# EasyEDA Pro project ProPrj_LillyPadPro_2025-09-27.epro

# Schematic LillyPadPro
Board Name: LillyPadPro; Create Date: 2025-09-27; Page Name: Sheet_1; Project Name: LillyPadPro; Schematic Name: LillyPadPro; Update Date: 2025-09-27; Add into BOM: yes; Company: Your Company; Convert to PCB: yes; Date: 2023-05-16; Draw By: waxcoin; REV: 1.0; Sheet: 1/1; spicePre: .
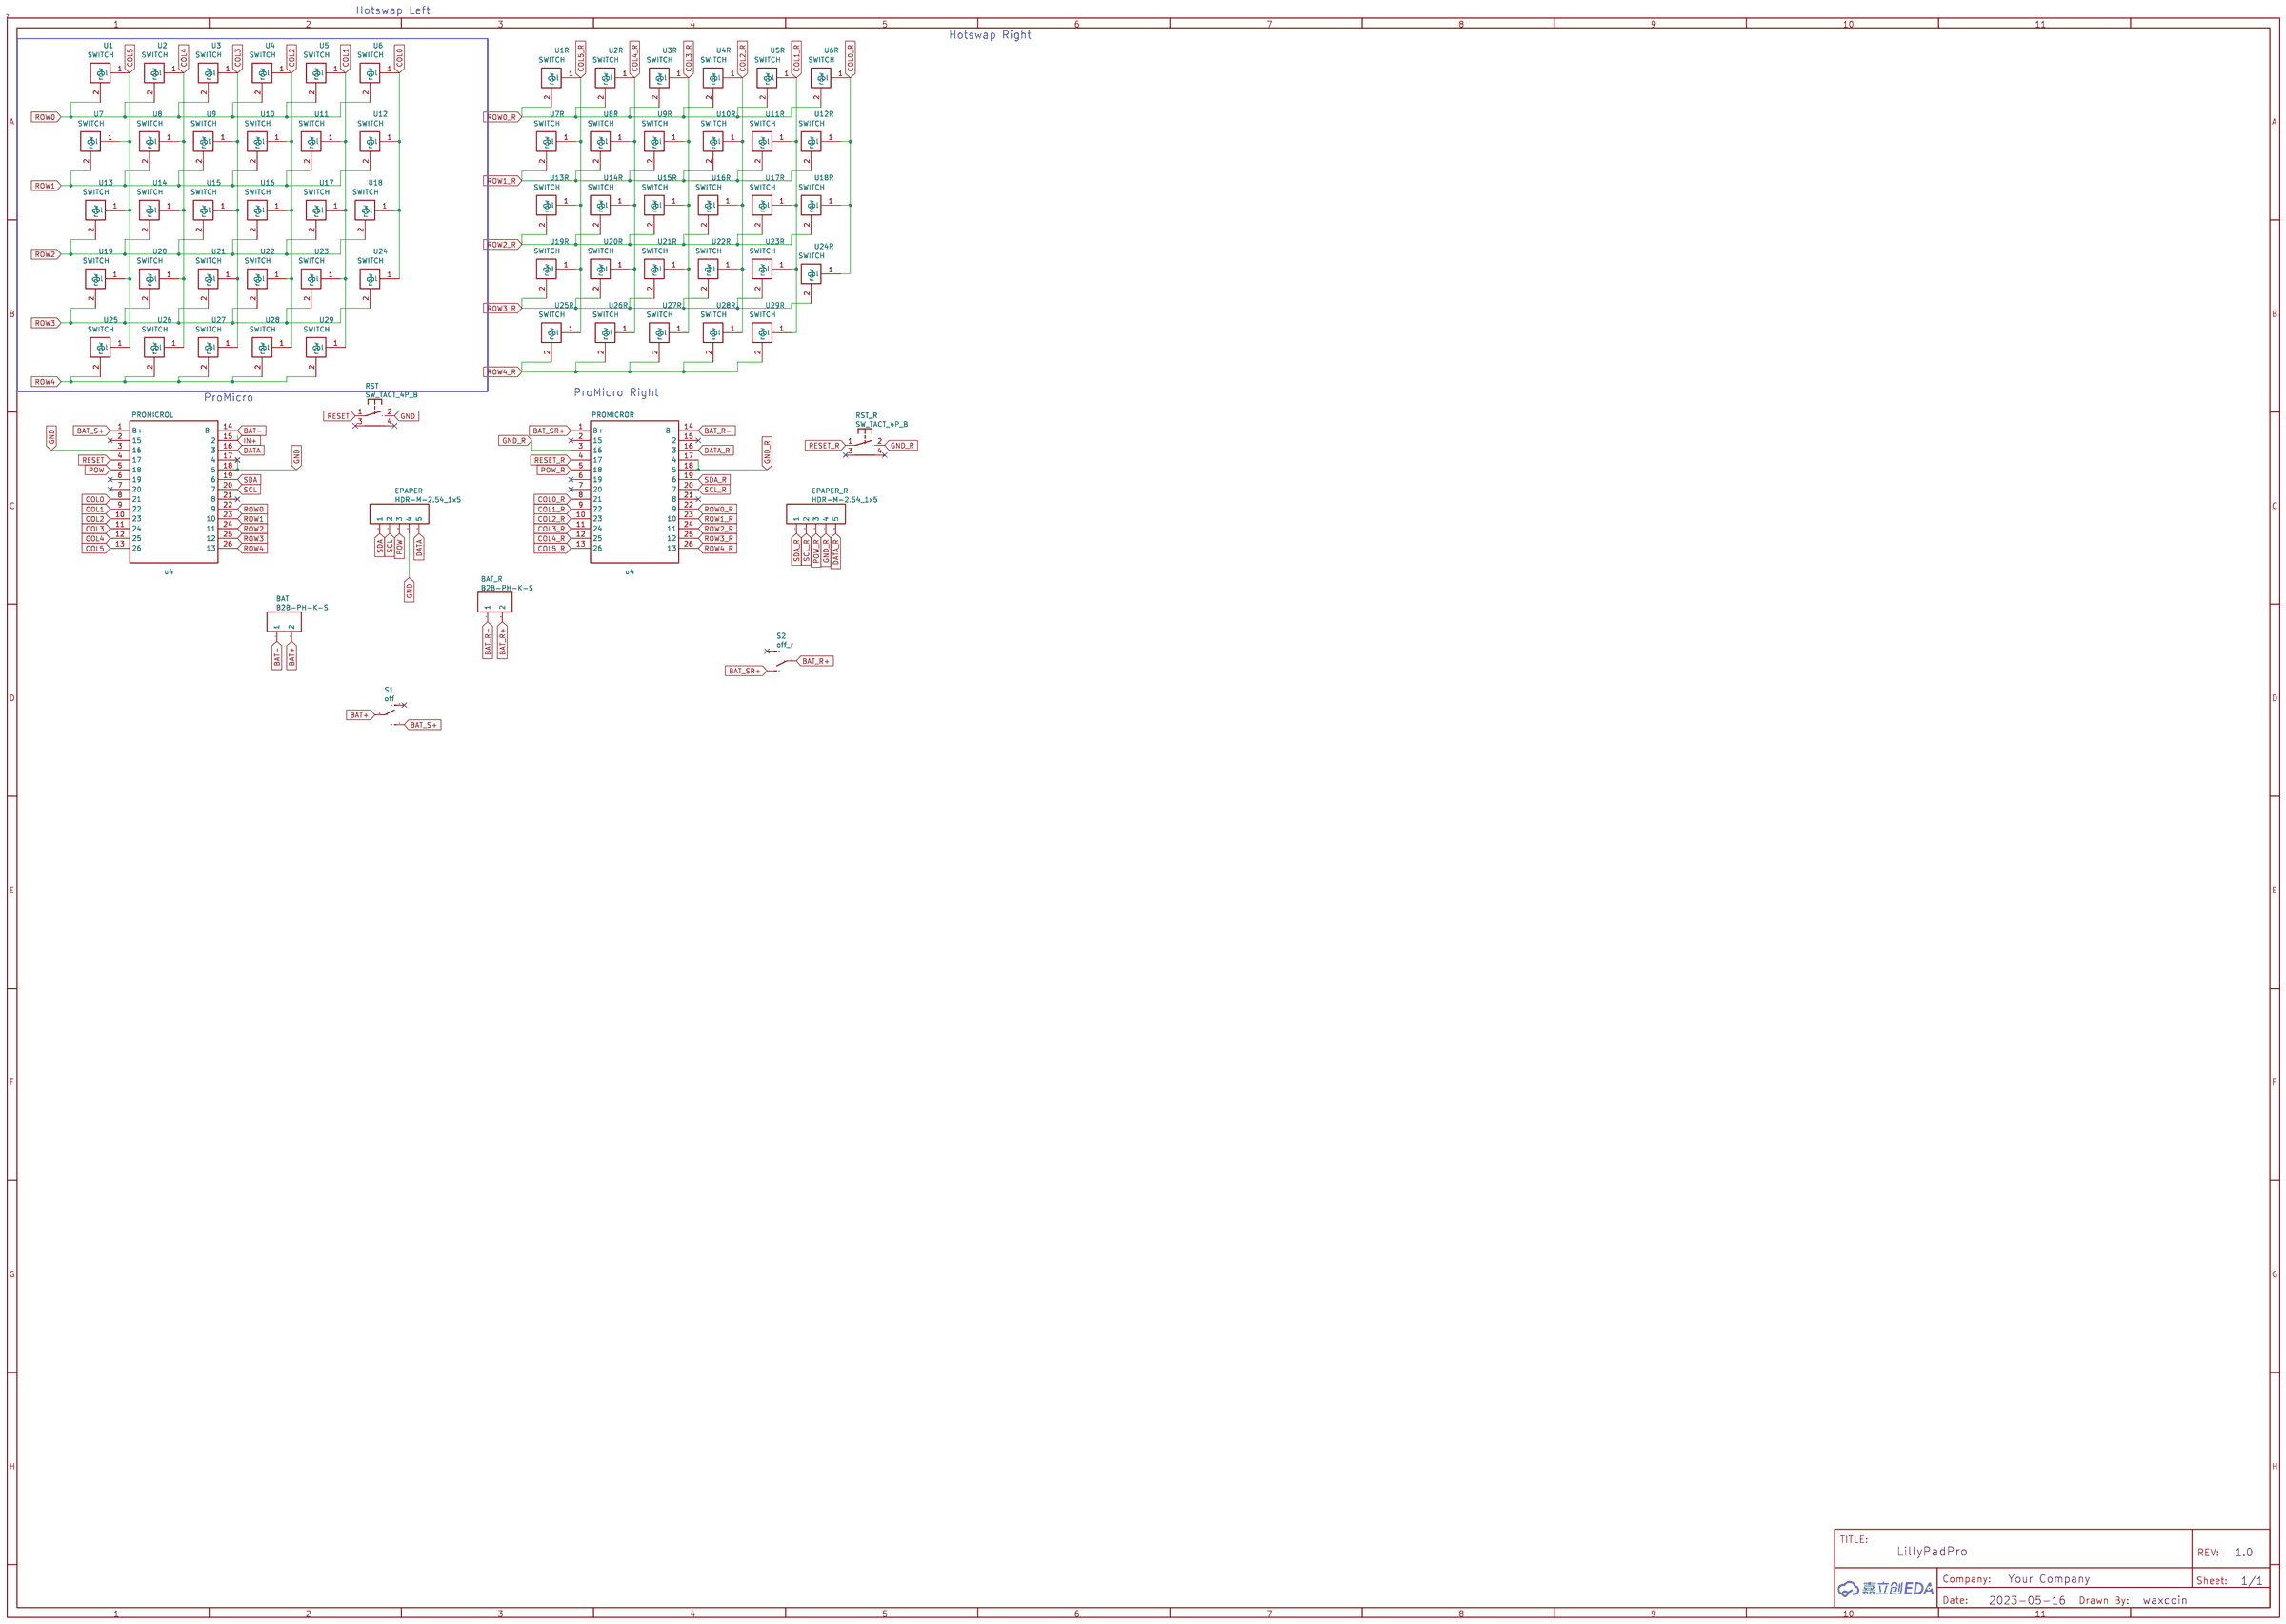
[diagram p0: schematic sheet]

## Parts
BAT  B2B-PH-K-S  [B2B-PH-K-S]
BAT_R  B2B-PH-K-S  [B2B-PH-K-S]
EPAPER  HDR-M-2.54_1x5  [NICE!VIEW - BASIC]
EPAPER_R  HDR-M-2.54_1x5  [NICE!VIEW - BASIC]
PROMICROL  u4  [NICE!NANO_HOTSWAP]
PROMICROR  u4  [NICE!NANO_HOTSWAP]
RST  SW_TACT_4P_B  [SW-SMD_L8.0-W3.5_3-6-3.5MM]
RST_R  SW_TACT_4P_B  [SW-SMD_L8.0-W3.5_3-6-3.5MM]
S1  off  [SWITCH-SPST-SMD-A]
S2  off_r  [SWITCH-SPST-SMD-A]
U1  SWITCH  [MXCHOC-HOTSWAP_WAX]
U1R  SWITCH  [MXCHOC-HOTSWAP_WAX]
U2  SWITCH  [MXCHOC-HOTSWAP_WAX]
U2R  SWITCH  [MXCHOC-HOTSWAP_WAX]
U3  SWITCH  [MXCHOC-HOTSWAP_WAX]
U3R  SWITCH  [MXCHOC-HOTSWAP_WAX]
U4  SWITCH  [MXCHOC-HOTSWAP_WAX]
U4R  SWITCH  [MXCHOC-HOTSWAP_WAX]
U5  SWITCH  [MXCHOC-HOTSWAP_WAX]
U5R  SWITCH  [MXCHOC-HOTSWAP_WAX]
U6  SWITCH  [MXCHOC-HOTSWAP_WAX]
U6R  SWITCH  [MXCHOC-HOTSWAP_WAX]
U7  SWITCH  [MXCHOC-HOTSWAP_WAX]
U7R  SWITCH  [MXCHOC-HOTSWAP_WAX]
U8  SWITCH  [MXCHOC-HOTSWAP_WAX]
U8R  SWITCH  [MXCHOC-HOTSWAP_WAX]
U9  SWITCH  [MXCHOC-HOTSWAP_WAX]
U9R  SWITCH  [MXCHOC-HOTSWAP_WAX]
U10  SWITCH  [MXCHOC-HOTSWAP_WAX]
U10R  SWITCH  [MXCHOC-HOTSWAP_WAX]
U11  SWITCH  [MXCHOC-HOTSWAP_WAX]
U11R  SWITCH  [MXCHOC-HOTSWAP_WAX]
U12  SWITCH  [MXCHOC-HOTSWAP_WAX]
U12R  SWITCH  [MXCHOC-HOTSWAP_WAX]
U13  SWITCH  [MXCHOC-HOTSWAP_WAX]
U13R  SWITCH  [MXCHOC-HOTSWAP_WAX]
U14  SWITCH  [MXCHOC-HOTSWAP_WAX]
U14R  SWITCH  [MXCHOC-HOTSWAP_WAX]
U15  SWITCH  [MXCHOC-HOTSWAP_WAX]
U15R  SWITCH  [MXCHOC-HOTSWAP_WAX]
U16  SWITCH  [MXCHOC-HOTSWAP_WAX]
U16R  SWITCH  [MXCHOC-HOTSWAP_WAX]
U17  SWITCH  [MXCHOC-HOTSWAP_WAX]
U17R  SWITCH  [MXCHOC-HOTSWAP_WAX]
U18  SWITCH  [MXCHOC-HOTSWAP_WAX]
U18R  SWITCH  [MXCHOC-HOTSWAP_WAX]
U19  SWITCH  [MXCHOC-HOTSWAP_WAX]
U19R  SWITCH  [MXCHOC-HOTSWAP_WAX]
U20  SWITCH  [MXCHOC-HOTSWAP_WAX]
U20R  SWITCH  [MXCHOC-HOTSWAP_WAX]
U21  SWITCH  [MXCHOC-HOTSWAP_WAX]
U21R  SWITCH  [MXCHOC-HOTSWAP_WAX]
U22  SWITCH  [MXCHOC-HOTSWAP_WAX]
U22R  SWITCH  [MXCHOC-HOTSWAP_WAX]
U23  SWITCH  [MXCHOC-HOTSWAP_WAX]
U23R  SWITCH  [MXCHOC-HOTSWAP_WAX]
U24  SWITCH  [MXCHOC-HOTSWAP_WAX]
U24R  SWITCH  [MXCHOC-HOTSWAP_WAX]
U25  SWITCH  [MXCHOC-HOTSWAP_WAX]
U25R  SWITCH  [MXCHOC-HOTSWAP_WAX]
U26  SWITCH  [MXCHOC-HOTSWAP_WAX]
U26R  SWITCH  [MXCHOC-HOTSWAP_WAX]
U27  SWITCH  [MXCHOC-HOTSWAP_WAX]
U27R  SWITCH  [MXCHOC-HOTSWAP_WAX]
U28  SWITCH  [MXCHOC-HOTSWAP_WAX]
U28R  SWITCH  [MXCHOC-HOTSWAP_WAX]
U29  SWITCH  [MXCHOC-HOTSWAP_WAX]
U29R  SWITCH  [MXCHOC-HOTSWAP_WAX]

## Library data of the parts
BAT BAT_R = B2B-PH-K-S: Supplier: RS-Online; Manufacturer: JST Sales America; Contributor: single_coil_hum; spicePre: J
EPAPER EPAPER_R = HDR-M-2.54_1x5: Supplier Part: C358687; Supplier: LCSC; Contributor: LCEDA_Lib; spicePre: J
PROMICROL PROMICROR = u4
RST RST_R = SW_TACT_4P_B: Contributor: DangerousPrototype; spicePre: S
S1 = off: Contributor: SparkFun; spicePre: S; spiceSymbolName: SWITCH-SPDT-SMD-A
S2 = off_r: Contributor: SparkFun; spicePre: S; spiceSymbolName: SWITCH-SPDT-SMD-A
U1 U1R U2 U2R U3 U3R U4 U4R U5 U5R U6 U6R U7 U7R U8 U8R U9 U9R U10 U10R U11 U11R U12 U12R U13 U13R U14 U14R U15 U15R U16 U16R U17 U17R U18 U18R U19 U19R U20 U20R U21 U21R U22 U22R U23 U23R U24 U24R U25 U25R U26 U26R U27 U27R U28 U28R U29 U29R = SWITCH: Contributor: angeloger087; spicePre: U; spiceSymbolName: CHERRY_MX_SWITCH

## Nets
GND: EPAPER.4 PROMICROL.3(16) PROMICROL.17(4) PROMICROL.18(5) RST.2
GND_R: EPAPER_R.4 PROMICROR.3(16) PROMICROR.17(4) PROMICROR.18(5) RST_R.2
BAT+: BAT.2 S1.2(P)
BAT-: BAT.1 PROMICROL.14(B-)
BAT_R+: BAT_R.2 S2.2(P)
BAT_R-: BAT_R.1 PROMICROR.14(B-)
BAT_S+: PROMICROL.1(B+) S1.3(S)
BAT_SR+: PROMICROR.1(B+) S2.1(O)
COL0: PROMICROL.8(21) U6.1(col) U12.1(col) U18.1(col) U24.1(col)
COL0_R: PROMICROR.8(21) U6R.1(col) U12R.1(col) U18R.1(col) U24R.1(col)
COL1: PROMICROL.9(22) U5.1(col) U11.1(col) U17.1(col) U23.1(col) U29.1(col)
COL1_R: PROMICROR.9(22) U5R.1(col) U11R.1(col) U17R.1(col) U23R.1(col) U29R.1(col)
COL2: PROMICROL.10(23) U4.1(col) U10.1(col) U16.1(col) U22.1(col) U28.1(col)
COL2_R: PROMICROR.10(23) U4R.1(col) U10R.1(col) U16R.1(col) U22R.1(col) U28R.1(col)
COL3: PROMICROL.11(24) U3.1(col) U9.1(col) U15.1(col) U21.1(col) U27.1(col)
COL3_R: PROMICROR.11(24) U3R.1(col) U9R.1(col) U15R.1(col) U21R.1(col) U27R.1(col)
COL4: PROMICROL.12(25) U2.1(col) U8.1(col) U14.1(col) U20.1(col) U26.1(col)
COL4_R: PROMICROR.12(25) U2R.1(col) U8R.1(col) U14R.1(col) U20R.1(col) U26R.1(col)
COL5: PROMICROL.13(26) U1.1(col) U7.1(col) U13.1(col) U19.1(col) U25.1(col)
COL5_R: PROMICROR.13(26) U1R.1(col) U7R.1(col) U13R.1(col) U19R.1(col) U25R.1(col)
DATA: EPAPER.5 PROMICROL.16(3)
DATA_R: EPAPER_R.5 PROMICROR.16(3)
IN+: PROMICROL.15(2)
POW: EPAPER.3 PROMICROL.5(18)
POW_R: EPAPER_R.3 PROMICROR.5(18)
RESET: PROMICROL.4(17) RST.1
RESET_R: PROMICROR.4(17) RST_R.1
ROW0: PROMICROL.22(9) U1.2(row) U2.2(row) U3.2(row) U4.2(row) U5.2(row) U6.2(row)
ROW0_R: PROMICROR.22(9) U1R.2(row) U2R.2(row) U3R.2(row) U4R.2(row) U5R.2(row) U6R.2(row)
ROW1: PROMICROL.23(10) U7.2(row) U8.2(row) U9.2(row) U10.2(row) U11.2(row) U12.2(row)
ROW1_R: PROMICROR.23(10) U7R.2(row) U8R.2(row) U9R.2(row) U10R.2(row) U11R.2(row) U12R.2(row)
ROW2: PROMICROL.24(11) U13.2(row) U14.2(row) U15.2(row) U16.2(row) U17.2(row) U18.2(row)
ROW2_R: PROMICROR.24(11) U13R.2(row) U14R.2(row) U15R.2(row) U16R.2(row) U17R.2(row) U18R.2(row)
ROW3: PROMICROL.25(12) U19.2(row) U20.2(row) U21.2(row) U22.2(row) U23.2(row) U24.2(row)
ROW3_R: PROMICROR.25(12) U19R.2(row) U20R.2(row) U21R.2(row) U22R.2(row) U23R.2(row) U24R.2(row)
ROW4: PROMICROL.26(13) U25.2(row) U26.2(row) U27.2(row) U28.2(row) U29.2(row)
ROW4_R: PROMICROR.26(13) U25R.2(row) U26R.2(row) U27R.2(row) U28R.2(row) U29R.2(row)
SCL: EPAPER.2 PROMICROL.20(7)
SCL_R: EPAPER_R.2 PROMICROR.20(7)
SDA: EPAPER.1 PROMICROL.19(6)
SDA_R: EPAPER_R.1 PROMICROR.19(6)

Not connected (* = marked no-connect by the designer): PROMICROL 2(15)* 6(19)* 7(20)* 21(8)*; PROMICROR 2(15)* 6(19)* 7(20)* 15(2)* 21(8)*; RST 3* 4*; RST_R 3* 4*; S1 1(O)*; S2 3(S)*

## Notes on the sheet
- Hotswap Left
- Hotswap Right
- ProMicro
- ProMicro Right

# Board PCB_LillyPadPro_2
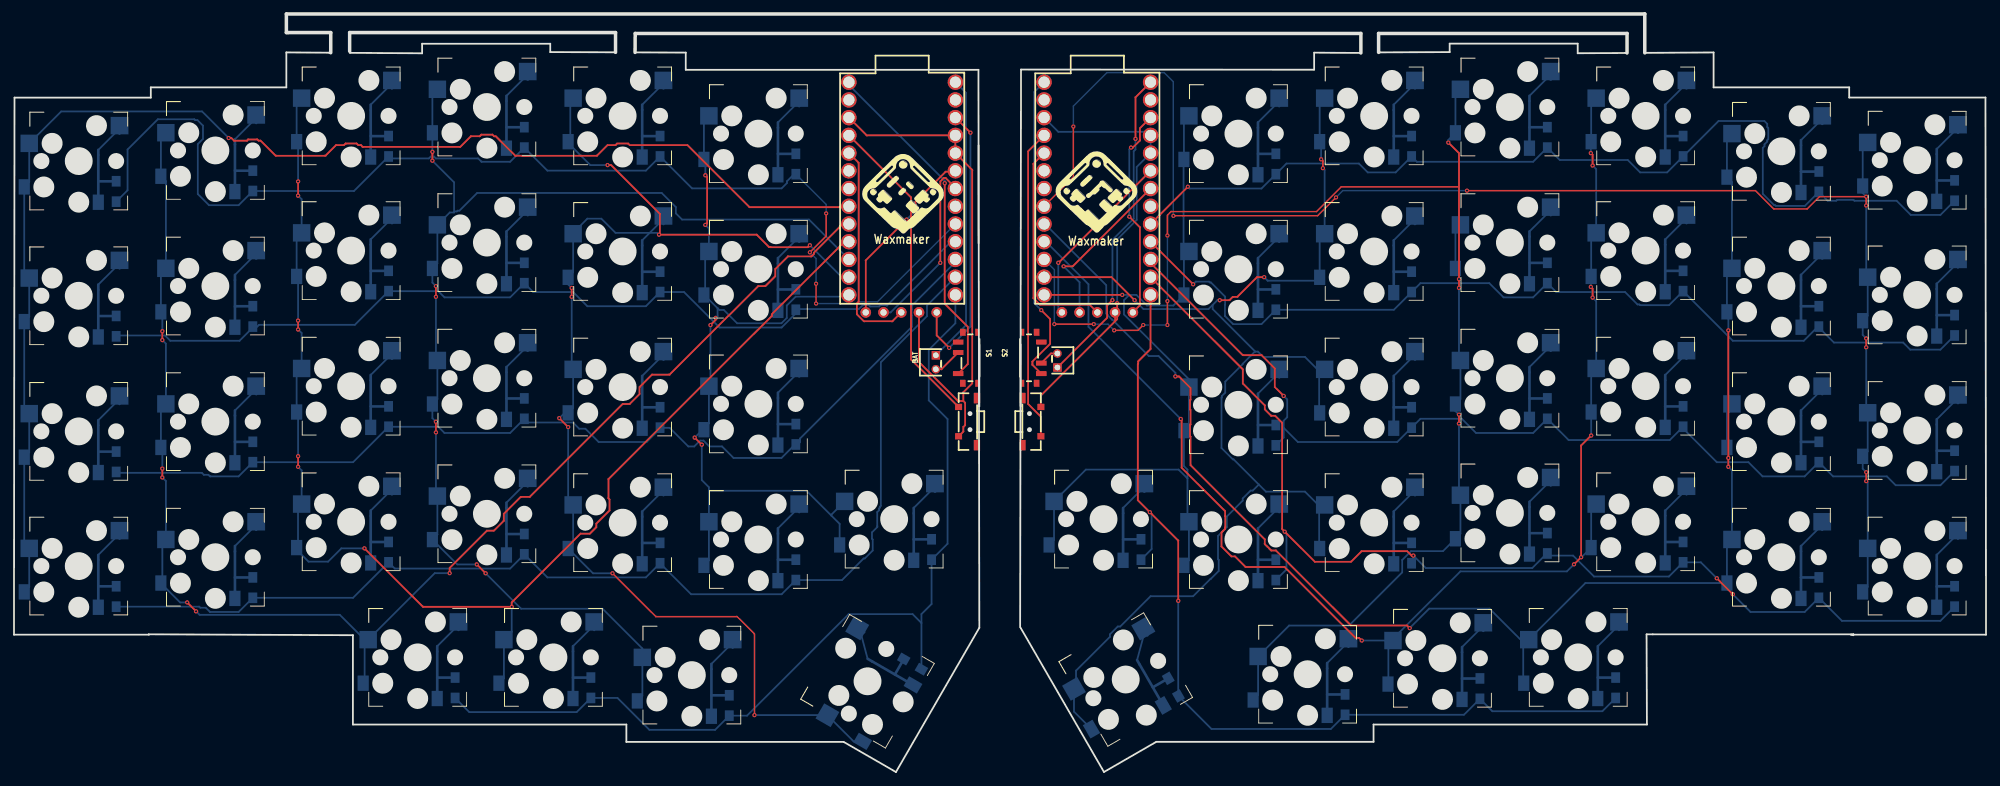
[diagram p1: board, top side]
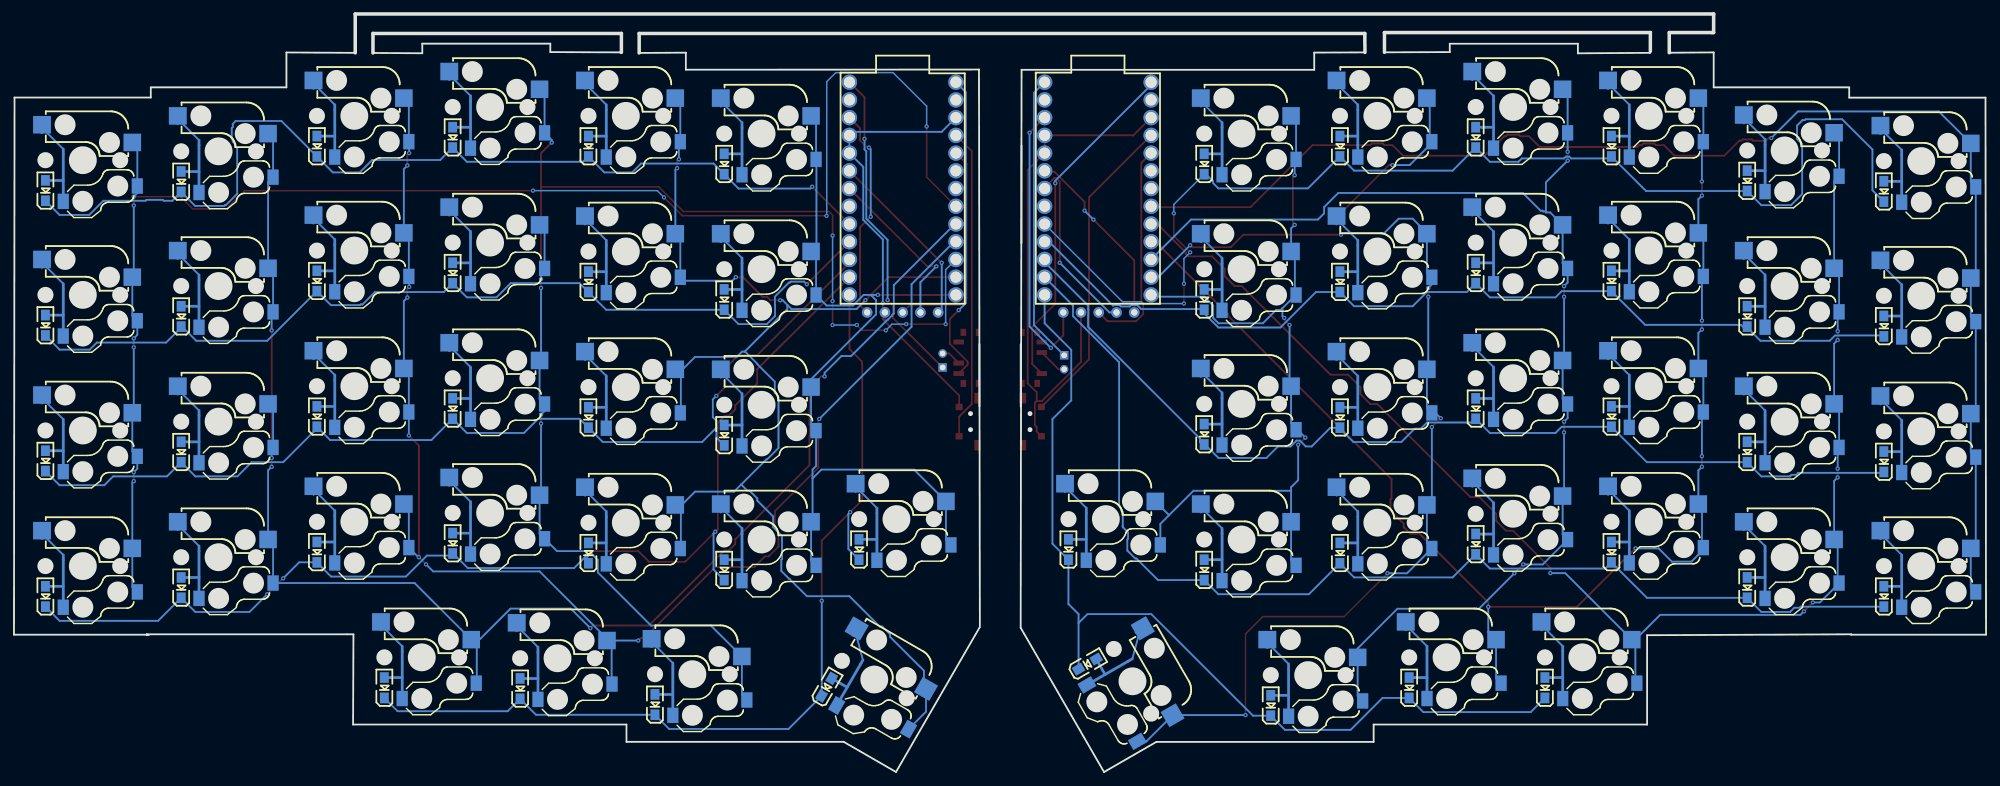
[diagram p2: board, bottom side, seen from below]

Outline 282.27 x 108.64 mm; copper layers: Top Layer, Bottom Layer. Coordinates in mm from the lower left corner of the outline.
Outline path: 48.05,103.3 48.05,105.97 86.11,105.97 86.11,103.14 76.76,103.17 76.76,104.37 58.42,104.37 58.42,103 48.14,103.06 48.06,103.06 ; 138.07,89.8 138.07,75.78 ; 138.18,52.38 138.18,61.29 ; 144.08,20.68 156.02,0.01 163.5,4.33 194.6,4.33 194.6,6.81 233.73,6.81 233.68,19.74 263.27,19.74 263.27,19.69 ; 144.08,52.38 144.08,61.29 ; 144.02,20.75 144.15,100.67 186.1,100.65 186.1,103.09 192.79,103.05 192.79,105.84 88.92,105.84 88.9,103.13 96.16,103.1 96.16,100.63 138.05,100.63 138.18,20.68 126.24,0 118.75,4.32 87.66,4.32 87.66,6.81 48.51,6.81 48.51,19.61 19.3,19.74 19.3,19.69 0,19.69 0.08,96.65 19.58,96.65 19.58,98.12 38.98,98.12 38.98,103.12 45.09,103.08 45.34,103.08 45.34,105.97 38.99,105.97 38.99,108.64 233.43,108.64 233.43,103.06 243.27,103.12 243.27,98.12 262.69,98.12 262.69,96.66 282.19,96.66 282.27,19.69 263.27,19.69 ; 263.27,19.69 262.95,19.69 263.27,19.61 263.27,19.69 ; 195.33,105.84 230.89,105.84 230.89,103.05 223.82,103 223.82,104.38 205.5,104.38 205.5,103.17 195.52,103.13 195.33,103.13 195.33,105.84
Stack: Top Layer 0.035mm / Dielectric1 1.51mm FR4 er 4.5 / Bottom Layer 0.035mm

## Design rules (mm)
template: JLCPCB Capability(Two Layers Board)
spacing copperThickness1oz (default): track to track 0.102, other pairs 0.152 to 0.3
spacing copperThickness2oz: track to track 0.203, other pairs 0.152 to 0.3
track width copperThickness1oz (default): min 0.127, default 0.254, max 2.54
track width copperThickness2oz: min 0.203, default 0.254, max 2.54
differential pair differentialPair (default): width min 0.127, default 0.254, max 2.54; gap min 0.152, default 0.152
via viaSize (default): diameter min 0.5, default 0.61, max 10; hole min 0.3, default 0.305, max 6.3

## Placement (name value [footprint] x y rotation side)
BAT  -  [B2B-PH-K-S]  131.95 58.72 90 top
BAT_R  -  [B2B-PH-K-S]  149.35 58.98 270 top
EPAPER  HDR-M-2.54_1x5  [NICE!VIEW - BASIC]  127 64.57 90 top
EPAPER_R  HDR-M-2.54_1x5  [NICE!VIEW - BASIC]  155.07 64.57 90 top
PROMICROL  u4  [NICE!NANO_HOTSWAP]  127.13 83.62 0 top
PROMICROR  u4  [NICE!NANO_HOTSWAP]  155.07 83.62 0 top
RST  SW_TACT_4P_B  [SW-SMD_L8.0-W3.5_3-6-3.5MM]  136.52 50.22 90 top
RST_R  SW_TACT_4P_B  [SW-SMD_L8.0-W3.5_3-6-3.5MM]  145.67 50.22 270 top
S1  off  [SWITCH-SPST-SMD-A]  136.52 59.36 270 top
S2  off_r  [SWITCH-SPST-SMD-A]  145.67 59.36 90 top
U1  SWITCH  [MXCHOC-HOTSWAP_WAX]  106.55 91.49 0 top
U1R  SWITCH  [MXCHOC-HOTSWAP_WAX]  175.26 91.49 0 top
U2  SWITCH  [MXCHOC-HOTSWAP_WAX]  87.12 94.03 0 top
U2R  SWITCH  [MXCHOC-HOTSWAP_WAX]  194.69 94.03 0 top
U3  SWITCH  [MXCHOC-HOTSWAP_WAX]  67.69 95.3 0 top
U3R  SWITCH  [MXCHOC-HOTSWAP_WAX]  214.12 95.3 0 top
U4  SWITCH  [MXCHOC-HOTSWAP_WAX]  48.26 94.03 0 top
U4R  SWITCH  [MXCHOC-HOTSWAP_WAX]  233.55 94.03 0 top
U5  SWITCH  [MXCHOC-HOTSWAP_WAX]  28.83 89.08 0 top
U5R  SWITCH  [MXCHOC-HOTSWAP_WAX]  252.98 88.95 0 top
U6  SWITCH  [MXCHOC-HOTSWAP_WAX]  9.27 87.55 0 top
U6R  SWITCH  [MXCHOC-HOTSWAP_WAX]  272.41 87.68 0 top
U7  SWITCH  [MXCHOC-HOTSWAP_WAX]  106.55 72.06 0 top
U7R  SWITCH  [MXCHOC-HOTSWAP_WAX]  175.26 72.06 0 top
U8  SWITCH  [MXCHOC-HOTSWAP_WAX]  87.12 74.6 0 top
U8R  SWITCH  [MXCHOC-HOTSWAP_WAX]  194.69 74.6 0 top
U9  SWITCH  [MXCHOC-HOTSWAP_WAX]  67.69 75.87 0 top
U9R  SWITCH  [MXCHOC-HOTSWAP_WAX]  214.12 75.87 0 top
U10  SWITCH  [MXCHOC-HOTSWAP_WAX]  48.26 74.73 0 top
U10R  SWITCH  [MXCHOC-HOTSWAP_WAX]  233.55 74.73 0 top
U11  SWITCH  [MXCHOC-HOTSWAP_WAX]  28.83 69.65 0 top
U11R  SWITCH  [MXCHOC-HOTSWAP_WAX]  252.98 69.65 0 top
U12  SWITCH  [MXCHOC-HOTSWAP_WAX]  9.27 68.25 0 top
U12R  SWITCH  [MXCHOC-HOTSWAP_WAX]  272.41 68.38 0 top
U13  SWITCH  [MXCHOC-HOTSWAP_WAX]  106.55 52.76 0 top
U13R  SWITCH  [MXCHOC-HOTSWAP_WAX]  175.26 52.63 0 top
U14  SWITCH  [MXCHOC-HOTSWAP_WAX]  87.12 55.17 0 top
U14R  SWITCH  [MXCHOC-HOTSWAP_WAX]  194.69 55.17 0 top
U15  SWITCH  [MXCHOC-HOTSWAP_WAX]  67.69 56.44 0 top
U15R  SWITCH  [MXCHOC-HOTSWAP_WAX]  214.12 56.44 0 top
U16  SWITCH  [MXCHOC-HOTSWAP_WAX]  48.26 55.3 0 top
U16R  SWITCH  [MXCHOC-HOTSWAP_WAX]  233.55 55.3 0 top
U17  SWITCH  [MXCHOC-HOTSWAP_WAX]  28.83 50.22 0 top
U17R  SWITCH  [MXCHOC-HOTSWAP_WAX]  252.98 50.22 0 top
U18  SWITCH  [MXCHOC-HOTSWAP_WAX]  9.27 48.82 0 top
U18R  SWITCH  [MXCHOC-HOTSWAP_WAX]  272.41 48.95 0 top
U19  SWITCH  [MXCHOC-HOTSWAP_WAX]  106.55 33.32 0 top
U19R  SWITCH  [MXCHOC-HOTSWAP_WAX]  175.26 33.32 0 top
U20  SWITCH  [MXCHOC-HOTSWAP_WAX]  87.12 35.74 0 top
U20R  SWITCH  [MXCHOC-HOTSWAP_WAX]  194.69 35.74 0 top
U21  SWITCH  [MXCHOC-HOTSWAP_WAX]  67.69 37.01 0 top
U21R  SWITCH  [MXCHOC-HOTSWAP_WAX]  214.12 37.13 0 top
U22  SWITCH  [MXCHOC-HOTSWAP_WAX]  48.26 35.86 0 top
U22R  SWITCH  [MXCHOC-HOTSWAP_WAX]  233.55 35.86 0 top
U23  SWITCH  [MXCHOC-HOTSWAP_WAX]  28.83 30.78 0 top
U23R  SWITCH  [MXCHOC-HOTSWAP_WAX]  252.98 30.78 0 top
U24  SWITCH  [MXCHOC-HOTSWAP_WAX]  9.27 29.51 0 top
U24R  SWITCH  [MXCHOC-HOTSWAP_WAX]  272.41 29.51 0 top
U25  SWITCH  [MXCHOC-HOTSWAP_WAX]  125.98 36.25 0 top
U25R  SWITCH  [MXCHOC-HOTSWAP_WAX]  155.96 36.25 0 top
U26  SWITCH  [MXCHOC-HOTSWAP_WAX]  122.17 13 60 top
U26R  SWITCH  [MXCHOC-HOTSWAP_WAX]  159.13 13.26 30 top
U27  SWITCH  [MXCHOC-HOTSWAP_WAX]  97.03 13.89 0 top
U27R  SWITCH  [MXCHOC-HOTSWAP_WAX]  185.17 14.02 0 top
U28  SWITCH  [MXCHOC-HOTSWAP_WAX]  77.22 16.43 0 top
U28R  SWITCH  [MXCHOC-HOTSWAP_WAX]  204.47 16.31 0 top
U29  SWITCH  [MXCHOC-HOTSWAP_WAX]  57.78 16.43 0 top
U29R  SWITCH  [MXCHOC-HOTSWAP_WAX]  223.9 16.43 0 top

## Footprints (pads in the part's own frame, mm; a bottom-side part is the same pattern mirrored in y, then rotated)
B2B-PH-K-S
  rect 1.212x1.212 hole 0.813: 1(1.004,0)
  round 1.212 hole 0.813: 2(-1.004,0)
MXCHOC-HOTSWAP_WAX
  custom 1.6x2.2 smd far side: (2.8,-5.9) 1(-7.8,-3.7)
  rect 1.27x1.524 smd far side: (5.357,-2.893) 2(5.357,-5.814)
  rect 2.55x2.5 smd far side: (5.842,5.08)
  rect 2.5x2.5 smd far side: 1(-7.085,2.54)
NICE!NANO_HOTSWAP
  round 2.2 hole 1.62: 1(-7.62,15.24)
  round 2.2 hole 1.6: 2(-7.62,12.7) 3(-7.62,10.16) 4(-7.62,7.62) 5(-7.62,5.08) 6(-7.62,2.54) 7(-7.62,0) 8(-7.62,-2.54) 9(-7.62,-5.08) 10(-7.62,-7.62) 11(-7.62,-10.16) 12(-7.62,-12.7) 13(-7.62,-15.24) 14(7.62,15.24) 15(7.62,12.7) 16(7.62,10.16) 17(7.62,7.62) 18(7.62,5.08) 19(7.62,2.54) 20(7.62,0) 21(7.62,-2.54) 22(7.62,-5.08) 23(7.62,-7.62) 24(7.62,-10.16) 25(7.62,-12.7) 26(7.62,-15.24)
NICE!VIEW - BASIC
  round 1.524 hole 0.914: 1(1.3,5.08) 2(1.3,2.54) 3(1.3,0) 4(1.3,-2.54) 5(1.3,-5.08)
SW-SMD_L8.0-W3.5_3-6-3.5MM
  rect 0.9x1 smd: 1(2.1,1.315) 2(-2.1,1.315)
  rect 1.5x0.9 smd: 3(3.375,-1.315) 4(-3.375,-1.315)
SWITCH-SPST-SMD-A
  rect 0.701x1.501 smd: 1(-2.26,-1.371) 2(-0.762,-1.371) 3(2.26,-1.371)
  rect 1.001x0.6 smd: GND1(-3.658,1.371) GND3(3.658,1.371)
  rect 1.001x0.8 smd: GND2(-3.658,-0.711) GND4(3.658,-0.711)

## Nets
As in the schematic.

Pads without a net: PROMICROL 2 6 7 21; PROMICROR 2 6 7 15 21; RST 3 4; RST_R 3 4; S1 1 GND1 GND2 GND3 GND4; S2 3 GND1 GND2 GND3 GND4

## Via types
v1: diameter 0.61, hole 0.305, Top Layer to Bottom Layer, 93 vias
v2: diameter 0.6, hole 0.3, Top Layer to Bottom Layer, 15 vias

## Routing (per net, layer and track width the routed paths; a pad name or vN(x,y) marks a point on that pad's centre or on a via; arc(x,y) is an arc through that point)
GND: length 77.2
  Top Layer w0.254: PROMICROL.3 122.05,91.24 PROMICROL.17 PROMICROL.18 137.16,86.28 137.16,55.71 135.89,54.44 135.89,53.17 ; RST.2 135.89,48.8 135.89,49.45 136.14,49.71 136.14,52.91 135.89,53.17 ; 135.89,53.17 135.13,53.17 129.54,58.75 EPAPER.4
GND_R: length 63
  Top Layer w0.254: 157.61,64.6 157.91,64.9 v1(157.91,67.18) ; 157.61,64.6 146.98,53.97 RST_R.2 ; 157.61,64.6 EPAPER_R.4
  Bottom Layer w0.254: PROMICROR.3 149.48,91.74 162.18,91.74 PROMICROR.17 PROMICROR.18 160.7,86.71 160.7,79.12 157.91,76.33 v1(157.91,67.18)
BAT+: length 4.2
  Top Layer w0.254: BAT.2 132.75,57.72 S1.2
BAT-: length 41.5
  Bottom Layer w0.254: PROMICROL.14 136.27,97.33 136.27,64.05 BAT.1
BAT_R+: length 2.9
  Top Layer w0.254: BAT_R.2 148.43,59.98 S2.2
BAT_R-: length 46.4
  Top Layer w0.254: PROMICROR.14 160.53,96.7 v1(160.53,90.74) ; BAT_R.1 156.46,65.09 156.46,66.87 v1(157.23,67.63)
  Bottom Layer w0.254: v1(157.23,67.63) 157.23,76.26 160.27,79.31 160.27,88.96 160.53,89.22 v1(160.53,90.74)
BAT_S+: length 49.4
  Top Layer w0.254: S1.3 136.52,58.47 136.52,63.8 133.22,67.11 v1(133.22,84.38)
  Bottom Layer w0.254: v1(133.22,84.38) 133.22,84.74 119.51,98.45 PROMICROL.1
BAT_SR+: length 44.9
  Top Layer w0.254: S2.1 145.77,58.37 145.77,58.83 148.31,61.37 148.31,64.92 v1(147.04,66.19)
  Bottom Layer w0.254: PROMICROR.1 146.02,97.43 146.02,67.21 v1(147.04,66.19)
COL0: length 195.8
  Top Layer w0.254: PROMICROL.8 119.38,80.95 105.28,80.95 96.39,89.84 88.14,89.84 87.92,90.06 86.32,90.06 86.1,89.84 84.96,89.84 83.44,88.32 71.76,88.32 68.96,91.11 68.71,91.11 68.49,91.33 66.89,91.33 66.67,91.11 65.41,91.11 63.88,89.59 49.91,89.59 49.66,89.84 49.28,89.84 49.06,90.06 47.46,90.06 47.24,89.84 46.1,89.84 44.58,88.32 37.47,88.32 35.31,90.47 35.01,90.47 34.83,90.66 33.53,90.66 33.35,90.47 31.5,90.47 31.11,90.86 v1(30.73,90.86)
  Bottom Layer w0.254: U24.1 2.19,26.53 U24.1 1.47,32.77 U18.1 2.19,45.83 U18.1 1.47,52.07 U12.1 2.19,65.27 2.19,70.79 1.47,71.5 U6.1 2.19,84.57 U6.1 6.76,94.67 26.92,94.67 v1(30.73,90.86)
COL0_R: length 221.2
  Top Layer w0.203: v2(151.64,92.51) 151.64,85.27 PROMICROR.8 ; 165.96,79.72 186.6,79.72 v2(189.23,82.35) ; 207.9,83.24 v2(207.98,83.31) 249.26,83.31 251.88,80.7 256.67,80.7 258.43,82.46 v1(265.12,82.46)
  Top Layer w0.254: v1(265.12,42.96) v1(265.12,41.69) ; v1(265.12,82.46) v1(265.12,81.19) ; v1(265.12,62.14) v1(265.12,60.87)
  Bottom Layer w0.203: v2(151.64,92.51) 151.64,95.43 156.44,100.23 164.63,100.23 165.94,98.92 165.94,79.72 ; v2(189.23,82.35) 190.2,83.31 v2(207.98,83.31)
  Bottom Layer w0.254: v1(265.12,62.14) 264.61,62.64 U12R.1 265.33,65.39 U12R.1 265.12,71.12 v1(265.12,81.19) ; U6R.1 264.61,89.51 U6R.1 264.61,82.96 v1(265.12,82.46) ; v1(265.12,60.87) 265.12,51.69 265.33,51.49 265.33,45.96 U18R.1 264.61,43.47 v1(265.12,42.96) ; U24R.1 265.33,26.53 U24R.1 265.33,41.48 v1(265.12,41.69)
  vias: v2(165.96,79.71)
COL1: length 202
  Top Layer w0.254: v1(26.06,23.04) v1(24.79,24.31) ; v1(21.24,42.21) v1(21.24,43.48) ; PROMICROL.9 118.62,78.54 114.5,74.42 114.5,74.23 114.16,73.89 110.78,73.89 108.97,72.09 108.97,71.06 107.56,69.64 106.53,69.64 93.83,56.95 91.33,56.95 89.54,55.16 89.54,54.17 88.12,52.75 87.13,52.75 73.82,39.43 72.55,39.43 70.11,37 70.11,36 68.69,34.59 67.7,34.59 62.36,29.24 v1(62.36,28.5) ; v1(21.24,61.9) v1(21.24,63.17)
  Bottom Layer w0.254: v1(26.06,23.04) 26.57,22.53 46.64,22.53 50.19,18.97 50.19,18.47 ; v1(24.79,24.31) 23.78,24.31 21.24,26.85 21.24,27.1 ; 50.19,18.47 U29.1 60.22,28.5 v1(62.36,28.5) ; 50.19,18.47 50.19,12.94 49.98,12.73 ; 21.24,27.1 21.24,32.82 U23.1 21.74,41.71 v1(21.24,42.21) ; 21.24,27.1 U23.1 ; v1(21.24,61.9) 21.74,61.39 U17.1 21.03,52.04 U17.1 21.24,46.31 v1(21.24,43.48) ; v1(21.24,63.17) 21.24,65.74 U11.1 21.03,71.47 U11.1 21.74,84.66 U5.1 21.03,90.9 U5.1
COL1_R: length 218.2
  Top Layer w0.254: v1(166.24,56.69) 166.75,56.69 168.4,55.04 168.4,53.35 168.33,53.28 168.33,51.98 168.4,51.91 168.4,49.79 168.33,49.72 168.33,48.12 168.4,48.05 168.4,43.97 179.03,33.34 179.03,32.67 179.96,31.75 180.63,31.75 191.37,21.01 199.39,21.01 199.74,20.65 ; v1(245.39,63.3) v1(245.39,45.01) v1(245.39,43.74)
  Bottom Layer w0.254: 216.1,12.73 216.03,12.81 216.03,19.1 ; v1(245.39,63.3) 245.39,65.74 U11R.1 245.18,71.47 U11R.1 245.9,84.54 U5R.1 245.18,90.78 U5R.1 ; v1(245.39,43.74) 245.9,43.23 U23R.1 245.18,32.61 U23R.1 224.93,27.09 U29R.1 216.69,19.1 216.03,19.1 ; PROMICROR.9 147.57,78.54 156.34,69.77 156.34,65.71 156.57,65.48 156.57,65.44 157.18,64.83 157.22,64.83 162.43,59.61 163.83,59.61 166.24,57.2 v1(166.24,56.69) ; 216.03,19.1 215.52,19.1 211.2,23.42 202.56,23.42 v1(199.77,20.62) ; v1(245.39,45.01) 245.39,46.31 U17R.1 245.18,52.04 U17R.1
COL2: length 187.9
  Top Layer w0.254: PROMICROL.10 118.87,76 108.48,65.6 108.48,65.37 85.09,41.98 85.09,39.22 85.24,39.08 85.24,37.48 83.35,35.59 83.35,35.08 82.42,34.16 81.1,34.16 71.25,24.31 v1(71.25,23.67) 58.55,23.67 v1(50.17,32.06) ; v1(40.67,63.42) v1(40.67,64.69) ; v1(40.67,82.6) v1(40.67,84.63) ; v1(40.67,43.74) v1(40.67,45.26)
  Bottom Layer w0.254: v1(40.67,82.6) 41.17,82.09 U10.1 40.46,76.55 U10.1 40.67,70.82 v1(40.67,64.69) ; U4.1 40.46,95.86 U4.1 40.67,90.12 v1(40.67,84.63) ; 40.66,32.16 40.66,37.89 U22.1 41.17,43.23 v1(40.67,43.74) ; 40.66,32.16 40.66,31.66 42.16,30.15 44.96,30.15 46.86,32.06 v1(50.17,32.06) ; 40.66,32.16 U22.1 ; 69.42,12.73 70.13,13.45 U28.1 71.25,20.09 v1(71.25,23.67) ; v1(40.67,63.42) 41.17,62.92 U16.1 40.46,57.12 U16.1 40.67,51.39 v1(40.67,45.26)
COL2_R: length 199.7
  Top Layer w0.254: v1(223.29,29.77) v1(224.31,30.78) 224.31,46.79 v1(225.75,48.23) ; v1(225.71,69.52) 225.96,69.27 v1(225.96,68) ; v1(192.91,18.85) 192.53,19.23 192.02,19.23 181.86,29.39 176.28,29.39 174.76,30.9 174.26,30.9 172.84,32.32 172.84,34.33 172.97,34.46 172.97,34.47 173.35,34.85 173.35,35.04 173.38,35.07 173.38,36.66 173.35,36.68 173.35,37.39 167.13,43.61 167.13,50.47 v1(167,50.6) ; v1(225.71,88.7) 225.96,88.44 v1(225.96,86.92)
  Bottom Layer w0.254: v1(192.91,18.85) 196.72,18.85 ; 196.72,18.85 196.72,12.66 U28R.1 ; 196.72,18.85 U28R.1 197.38,19.1 207.04,28.75 222.28,28.75 v1(223.29,29.77) ; PROMICROR.10 147.7,76 153.8,69.9 153.8,63.8 v1(167,50.6) ; v1(225.96,86.92) 226.47,86.41 U10R.1 225.75,76.55 U10R.1 225.71,70.98 v1(225.71,69.52) ; U4R.1 225.75,95.86 U4R.1 225.71,90.28 v1(225.71,88.7) ; U22R.1 225.75,37.69 U22R.1 224.37,30.78 v1(224.31,30.78) ; v1(225.96,68) 226.47,67.49 U16R.1 225.75,57.12 U16R.1 v1(225.75,48.23)
COL3: length 175.4
  Top Layer w0.254: v1(59.89,87.61) v1(59.89,88.88) ; v1(60.4,50.2) v1(60.4,48.67) ; v1(66.24,29.75) v1(67.51,28.48) ; v1(60.4,69.63) v1(60.4,68.11)
  Bottom Layer w0.254: 89.23,10.19 89.94,10.91 U27.1 89.94,17.7 84.24,23.4 72.59,23.4 v1(67.51,28.48) ; 62.99,80.25 62.99,84.51 v1(59.89,87.61) ; 62.99,80.25 62.99,80.19 62.38,80.19 U9.1 60.61,72.88 U9.1 59.89,70.14 v1(60.4,69.63) ; 62.99,80.25 63.08,80.34 63.39,80.34 63.5,80.44 63.75,80.44 66.29,82.98 92.71,82.98 94.74,80.95 94.74,80.06 95.63,79.17 113.79,79.17 PROMICROL.11 ; 62.99,80.25 62.96,80.22 ; v1(60.4,68.11) 60.4,59.19 U15.1 60.61,53.45 U15.1 59.89,50.71 v1(60.4,50.2) ; v1(60.4,48.67) 60.4,39.75 U21.1 60.61,34.02 U21.1 63.45,29.75 v1(66.24,29.75) ; U3.1 59.89,97.13 U3.1 v1(59.89,88.88)
COL3_R: length 203.7
  Top Layer w0.203: v2(154.56,64.19) v2(148.91,64.19) ; v2(157.48,63.3) 160.87,63.3 v2(161.63,64.06) ; v2(165.1,76.89) 165.1,79.81 165.61,80.31 186.44,80.31 189.98,83.86 206.83,83.86 ; v2(165.1,67.49) v2(165.1,64.06)
  Top Layer w0.254: v1(206.83,51.21) v1(206.83,49.94) ; v1(205.31,90.2) 206.83,88.68 v1(206.83,70.65) v1(206.83,69.38)
  Bottom Layer w0.203: PROMICROR.11 148.91,71.99 v2(148.91,64.19) ; v2(154.56,64.19) 156.59,64.19 v2(157.48,63.3) ; v2(165.1,76.89) v2(165.1,67.49) ; v2(165.1,64.06) v2(161.63,64.06)
  Bottom Layer w0.254: U9R.1 206.32,77.69 U9R.1 206.83,71.66 v1(206.83,70.65) ; v1(206.83,51.21) 206.32,51.72 U15R.1 207.04,53.45 U15R.1 206.83,59.19 v1(206.83,69.38) ; v1(205.31,90.2) 205.31,90.58 U3R.1 206.32,97.13 U3R.1 ; U27R.1 178.08,11.04 U27R.1 182.51,20.99 191.08,20.99 198.7,28.61 198.7,30.39 199.97,31.66 204.54,31.66 U21R.1 207.04,34.15 U21R.1 206.83,39.88 v1(206.83,49.94)
COL4: length 179.7
  Top Layer w0.203: v1(85.67,28.48) 91.88,22.28 103.51,22.28 105.99,19.79 v1(105.99,8.16)
  Top Layer w0.254: v1(113.92,75.49) 113.64,75.21 108.29,75.21 108.27,75.23 108.08,75.23 106.3,77.01 v1(92.33,77.01) 92.46,77.14 92.46,79.99 85.47,86.98 v1(84.96,86.98) ; v1(79.83,69.38) v1(79.83,68.11) ; v1(78.05,50.71) v1(79.32,49.44)
  Bottom Layer w0.254: U2.1 79.63,96.16 79.63,90.28 ; v1(105.99,8.16) 116.41,8.16 U26.1 120.17,4.4 U26.1 ; 79.63,90.28 79.63,89.84 82.49,86.98 v1(84.96,86.98) ; 79.63,90.28 79.38,90.28 U2.1 ; v1(79.32,49.44) 79.32,38.99 80.04,38.28 80.04,32.75 79.32,32.04 82.88,28.48 v1(85.67,28.48) ; v1(79.83,68.11) 79.83,57.92 U14.1 80.04,52.18 U14.1 78.81,51.47 v1(78.05,50.71) ; v1(113.92,75.49) 118.49,70.92 PROMICROL.12 ; v1(92.33,77.01) 92.08,77.27 86.11,77.27 84.07,79.3 82.07,79.3 80.04,77.27 U8.1 80.04,71.61 U8.1 79.32,69.88 v1(79.83,69.38)
COL4_R: length 188.3
  Top Layer w0.254: v1(172.59,67.61) 173.98,67.61 174.46,68.09 175.1,68.09 177.93,70.92 v1(178.94,70.92) ; v1(187.35,86.54) 187.35,87.55 v1(187.1,87.81) ; v1(160.4,67.61) 157.1,70.92 PROMICROR.12
  Bottom Layer w0.254: v1(178.94,70.92) 179.45,70.41 186.4,70.41 U8R.1 186.89,76.42 U8R.1 187.61,86.28 v1(187.35,86.54) ; U2R.1 186.89,95.86 U2R.1 187.1,90.12 v1(187.1,87.81) ; 177.67,60.25 171.58,66.34 171.58,66.94 ; 177.67,60.25 177.61,60.25 175.87,58.51 175.87,58.45 173.38,55.95 173.38,54.37 172.88,53.88 172.88,53.67 172.84,53.63 172.84,46.43 174.46,44.81 174.57,44.81 178.18,41.2 ; 177.67,60.25 178.05,60.25 178.82,59.49 184.78,59.49 186.56,57.71 186.82,57.71 ; 186.82,57.71 186.82,51.54 U14R.1 ; 186.82,57.71 U14R.1 ; 178.18,41.2 177.31,40.33 177,40.33 175.87,39.2 175.87,38.89 173.61,36.63 173.61,35.1 172.34,33.83 172.34,30.52 172.44,30.41 172.44,28.82 171.31,27.69 171.28,27.69 168.78,25.2 162.69,25.2 158.35,20.86 157.99,20.86 156.86,19.73 156.86,19.37 152.02,14.53 152.02,11.96 151.98,11.92 151.72,11.92 151.72,8.66 U26R.1 ; 178.18,41.2 179.2,40.18 184.78,40.18 186.56,38.41 186.82,38.41 ; 186.82,38.41 186.82,32.11 186.89,32.04 ; 186.82,38.41 187.48,38.41 187.61,38.28 ; 171.58,66.94 170.98,66.34 161.67,66.34 v1(160.4,67.61) ; 171.58,66.94 172.25,67.61 v1(172.59,67.61)
COL5: length 117.9
  Top Layer w0.254: v1(100.46,65.07) 100.46,64.82 v1(99.7,64.06) ; v1(97.44,47.93) v1(98.45,46.91) ; v1(98.96,78.41) 99.21,78.66 99.21,85.27 v1(98.96,85.52)
  Bottom Layer w0.254: 98.71,49.2 99.47,49.96 U13.1 99.7,55.52 v1(99.7,64.06) ; 98.71,49.2 U13.1 ; 98.71,49.2 v1(97.44,47.93) ; 116.99,36.75 118.18,35.56 U25.1 ; 116.99,36.75 113.44,40.31 99.47,40.31 ; 116.99,36.75 116.99,36.88 U25.1 ; 98.93,68.38 98.93,68.25 100.71,66.47 ; 98.93,68.38 98.75,68.36 ; 98.93,68.38 98.93,74.07 U7.1 99.47,77.9 v1(98.96,78.41) ; v1(98.45,46.91) 98.45,41.83 99.47,40.82 99.47,40.31 ; 99.47,40.31 U19.1 99.47,30.34 U19.1 ; v1(98.96,85.52) 98.96,87.58 U1.1 98.75,93.32 U1.1 ; 100.71,66.47 100.71,65.33 v1(100.46,65.07) ; 100.71,66.47 100.96,66.22 101.6,66.22 103.51,64.31 109.86,64.31 110.62,65.07 110.62,66.85 111.89,68.12 119.25,68.12 PROMICROL.13
COL5_R: length 119.7
  Top Layer w0.254: PROMICROR.13 v1(158.62,68.38)
  Bottom Layer w0.254: 167.97,42.07 167.97,43.34 167.46,43.85 U13R.1 168.17,49.64 U13R.1 168.17,56.29 158.88,65.58 158.88,67.61 159.64,68.38 ; 167.97,42.07 167.97,36.07 U19R.1 168.17,30.34 U19R.1 ; 167.97,42.07 166.7,43.34 153.43,43.34 U25R.1 148.87,33.26 U25R.1 ; 159.64,68.38 160.66,68.38 162.18,66.85 165.95,66.85 167.46,68.36 167.46,73.88 U7R.1 167.41,75.36 167.41,87.74 U1R.1 167.46,93.32 U1R.1 ; 159.64,68.38 v1(158.62,68.38)
DATA: length 41
  Top Layer w0.254: EPAPER.5 132.08,62.56 v1(133.86,60.79) ; v1(136.91,91.62) PROMICROL.16
  Bottom Layer w0.254: v1(133.86,60.79) 136.91,63.83 v1(136.91,91.62)
DATA_R: length 30.4
  Top Layer w0.254: v1(159.89,89.49) 160.15,89.49 161.16,90.5 161.16,92.25 PROMICROR.16 ; v1(159.64,79.58) 161.16,78.06 161.16,66.88 EPAPER_R.5
  Bottom Layer w0.254: v1(159.64,79.58) 159.64,89.23 v1(159.89,89.49)
POW: length 31.1
  Top Layer w0.254: PROMICROL.5 120.9,87.3 120.9,67.39 120.65,67.14 120.65,65.61 121.67,64.6 125.73,64.6 EPAPER.3
POW_R: length 31.4
  Top Layer w0.254: EPAPER_R.3 153.97,66.96 146.86,66.96 145.92,67.9 145.92,87.17 PROMICROR.5
RESET: length 45.4
  Top Layer w0.254: RST.1 128.4,59.13 128.4,82.35 PROMICROL.4
RESET_R: length 44.8
  Top Layer w0.254: RST_R.1 146.98,50.93 145.16,52.76 145.16,88.95 PROMICROR.4
ROW0: length 173.1
  Top Layer w0.203: v2(113.92,74.47) 116.25,76.81 116.25,79.99 ; v2(114.81,67.14) v2(114.81,69.97)
  Bottom Layer w0.203: v2(113.92,74.47) 114.81,73.58 v2(114.81,69.97) ; U1.2 116.25,81.33 v2(116.25,80.06) ; v2(114.81,67.14) 120.65,67.14 120.9,67.39 123.6,67.39 PROMICROL.22
  Bottom Layer w0.254: U6.2 16.26,83.37 16.26,89.21 20.59,93.54 25.82,93.54 25.94,93.42 26.26,93.42 27.05,92.63 27.05,90.72 26.31,89.98 26.31,82.83 27.91,81.23 32.15,81.23 U5.2 48.66,83.26 U4.2 53.9,87.93 59.39,87.93 59.65,88.19 60.13,88.19 60.39,87.93 66.44,87.93 66.89,87.48 66.92,87.48 66.95,87.45 71.02,87.45 U3.2 76.35,86.18 90.45,86.18 U2.2 97.05,83.64 109.88,83.64 110.64,84.41 110.64,84.66 111.66,85.68 U1.2
ROW0_R: length 141.1
  Top Layer w0.254: PROMICROR.22 v1(168.02,83.87)
  Bottom Layer w0.254: v1(168.02,83.87) 168.27,83.62 178.56,83.62 U1R.2 182.14,87.2 192.5,87.2 193.77,85.93 197.76,85.93 U2R.2 200.81,87.45 217.45,87.45 U3R.2 221.26,87.71 230.99,87.71 232.76,85.93 236.62,85.93 U4R.2 243.99,93.3 250.54,93.3 250.95,92.89 250.95,92.44 251.1,92.29 251.1,90.69 250.95,90.54 250.95,90.34 250.56,89.95 250.56,89.69 250.32,89.44 250.32,82.85 251.94,81.23 252.09,81.23 252.19,81.13 256.34,81.13 U5R.2 259.61,81.87 260.82,81.87 260.96,82 263.3,82 263.43,81.87 269.47,81.87 271.5,79.83 275.74,79.83 U6R.2
ROW1: length 134.7
  Bottom Layer w0.254: U12.2 14.75,62.56 21.61,62.56 22.37,61.8 32.28,61.8 34.31,63.83 ; 34.31,63.83 U11.2 ; 34.31,63.83 34.82,63.83 35.08,64.09 48.79,64.09 U10.2 60.73,68.91 61.62,68.02 71.02,68.02 U9.2 74.32,68.79 80.03,68.79 82.06,66.75 90.45,66.75 U8.2 95.91,68.79 100.99,63.71 109.88,63.71 111.91,65.74 U7.2 112.01,66.34 120.93,66.34 121.49,66.91 122.35,66.91 122.53,66.73 123.85,66.73 124.03,66.91 124.89,66.91 124.96,66.84 134.11,76 PROMICROL.23
ROW1_R: length 134.3
  Top Layer w0.254: PROMICROR.23 v1(168.78,69.9)
  Bottom Layer w0.254: 258.21,63.83 U11R.2 ; 258.21,63.83 260.5,61.55 270.41,61.55 271.42,60.53 275.74,60.53 U12R.2 ; 258.21,63.83 256.18,61.8 246.02,61.8 U10R.2 236.91,66.91 232.75,66.91 232.65,67.01 232.38,67.01 230.6,68.79 220.75,68.79 U9R.2 217.45,68.02 213.21,68.02 211.17,70.06 201.32,70.06 U8R.2 197.51,66.25 U7R.2 178.56,64.19 174.5,64.19 173.35,65.33 173.35,65.35 173.33,65.37 173.33,66.97 173.35,66.99 173.35,68.12 171.32,70.16 171.18,70.16 171.06,70.28 169.16,70.28 v1(168.78,69.9)
ROW2: length 143.6
  Bottom Layer w0.254: 92.58,49.33 93.85,49.33 96.52,46.66 97.37,46.66 98.21,47.5 98.69,47.5 99.53,46.66 101.35,46.66 103,45.01 109.86,45.01 111.89,47.04 ; 92.58,49.33 U14.2 ; 92.58,49.33 90.55,47.29 83.69,47.29 81.79,49.2 80.9,49.2 80.01,50.09 73.58,50.09 U15.2 71.02,48.59 61.62,48.59 60.73,49.48 U16.2 48.54,44.4 U17.2 32.15,42.37 28.09,42.37 28.06,42.4 28.03,42.4 27.83,42.6 27.18,42.6 26.9,42.88 14.75,42.88 U18.2 ; 111.89,47.04 U13.2 ; 111.89,47.04 112.27,47.04 112.52,47.29 112.52,47.8 128.52,63.8 128.52,65.41 128.5,65.44 128.5,66.3 128.52,66.32 128.52,66.85 134.75,73.08 PROMICROL.24
ROW2_R: length 145
  Top Layer w0.254: PROMICROR.24 162.69,72.95 175.89,59.74 178.56,59.74 180.47,57.84 180.47,55.17 v1(181.74,53.9)
  Bottom Layer w0.254: 238.78,49.35 U16R.2 ; 238.78,49.35 237,47.58 222.53,47.58 U15R.2 217.45,48.59 209.27,48.59 207.24,50.62 201.32,50.62 U14R.2 197.99,47.29 183.77,47.29 181.74,49.33 ; 238.78,49.35 243.74,44.4 248.26,44.4 250.29,42.37 256.31,42.37 U17R.2 260.37,42.37 268.07,42.37 269.34,41.1 275.74,41.1 U18R.2 ; U13R.2 181.74,47.93 181.74,49.33 ; 181.74,49.33 181.74,50.34 182.24,50.85 182.24,53.39 v1(181.74,53.9)
ROW3: length 163.6
  Bottom Layer w0.254: U24.2 26.52,23.7 26.67,23.55 27.45,23.55 28.03,22.97 28.06,22.97 28.09,22.94 32.15,22.94 U23.2 48.54,24.97 U22.2 54.51,29.16 71.02,29.16 U21.2 76.35,27.89 90.45,27.89 U20.2 96.92,25.48 109.88,25.48 U19.2 118.52,27.51 121.62,30.61 121.78,30.61 122.91,31.74 122.91,33.34 122.81,33.44 122.81,34.34 123.57,35.1 123.57,35.23 123.56,35.24 123.56,37.25 123.83,37.51 123.83,37.77 123.95,37.9 123.95,38.02 124.08,38.15 124.08,58.72 130.68,65.33 130.68,66.85 PROMICROL.25
ROW3_R: length 162.1
  Top Layer w0.254: v1(243.74,27.76) v1(246.02,25.48) ; v1(200.3,31.02) 200.05,31.02 199.41,31.65 192.89,31.65 191.37,30.13 186.2,30.13 v1(181.89,34.44) 181.51,34.82 181.51,50.06 180.52,51.05 179.96,51.05 179.03,51.98 179.03,52.54 175.89,55.68 175.89,57.71 PROMICROR.25
  Bottom Layer w0.254: U24R.2 275.74,21.67 261.64,21.67 U23R.2 256.31,22.94 248.56,22.94 v1(246.02,25.48) ; 219.35,31.02 223.16,31.02 226.16,28.02 236.88,28.02 U22R.2 241.45,30.05 v1(243.74,27.76) ; 219.35,31.02 219.35,31.19 U21R.2 ; 219.35,31.02 219.1,31.02 217.32,29.24 202.08,29.24 v1(200.3,31.02) 200.3,30.18 U20R.2 ; U19R.2 182.14,29.03 182.14,34.19 v1(181.89,34.44)
ROW4: length 135.6
  Bottom Layer w0.254: 129.89,21.36 129.89,22.63 131.34,24.08 U25.2 133.63,32.72 133.63,50.57 130.94,53.26 130.94,60.5 134.75,64.31 PROMICROL.26 ; 129.89,21.36 U26.2 ; 129.89,21.36 128.62,22.63 119.47,22.63 104.92,8.08 U27.2 100.35,6.05 90.95,6.05 86.38,10.62 U28.2 80.54,8.59 65.17,8.59 U29.2
ROW4_R: length 136
  Top Layer w0.254: v1(166.65,24.54) 166.65,33.17 v1(162.58,37.24) 160.86,38.96 160.86,58.47 160.91,58.52 160.91,58.85 162.69,60.63 PROMICROR.26
  Bottom Layer w0.254: v1(166.65,24.54) 166.65,10.93 166.68,10.9 171.41,6.17 188.49,6.17 U27R.2 207.54,8.21 U28R.2 211.6,8.71 227.35,8.71 U29R.2 ; U25R.2 162.84,31.96 162.84,36.98 v1(162.58,37.24)
SCL: length 25.8
  Top Layer w0.254: v1(132.59,72.98) 132.59,84.63 133.1,85.14 133.35,85.14 134.62,83.87 134.62,83.74 PROMICROL.20
  Bottom Layer w0.254: EPAPER.2 125.48,65.87 v1(132.59,72.98)
SCL_R: length 24.6
  Top Layer w0.254: v1(150.24,72.47) 151.54,72.47 PROMICROR.20
  Bottom Layer w0.254: v1(150.24,72.47) 152.53,70.18 EPAPER_R.2
SDA: length 26.3
  Top Layer w0.254: EPAPER.1 121.92,73.33 v1(127.76,79.17) ; v1(129.03,80.44) 129.03,81.71 133.35,86.03 134.62,86.03 PROMICROL.19
  Bottom Layer w0.254: v1(127.76,79.17) v1(129.03,80.44)
SDA_R: length 26
  Top Layer w0.254: PROMICROR.19 149.51,72.98 v1(149.48,72.98)
  Bottom Layer w0.254: v1(149.48,72.98) 149.48,66.38 EPAPER_R.1

## Text on the board
Top Silkscreen Layer: Waxmaker
